# Altium schematic sheet digital_io.SchDoc: foxBMS BMS-Slave 12-Cell
size A3; DocumentNumber: 11; SheetNumber: 11; SheetTotal: 11; AUTHOR: Fraunhofer IISB foxBMS Team; SheetDescription: Digital Inputs/Outputs
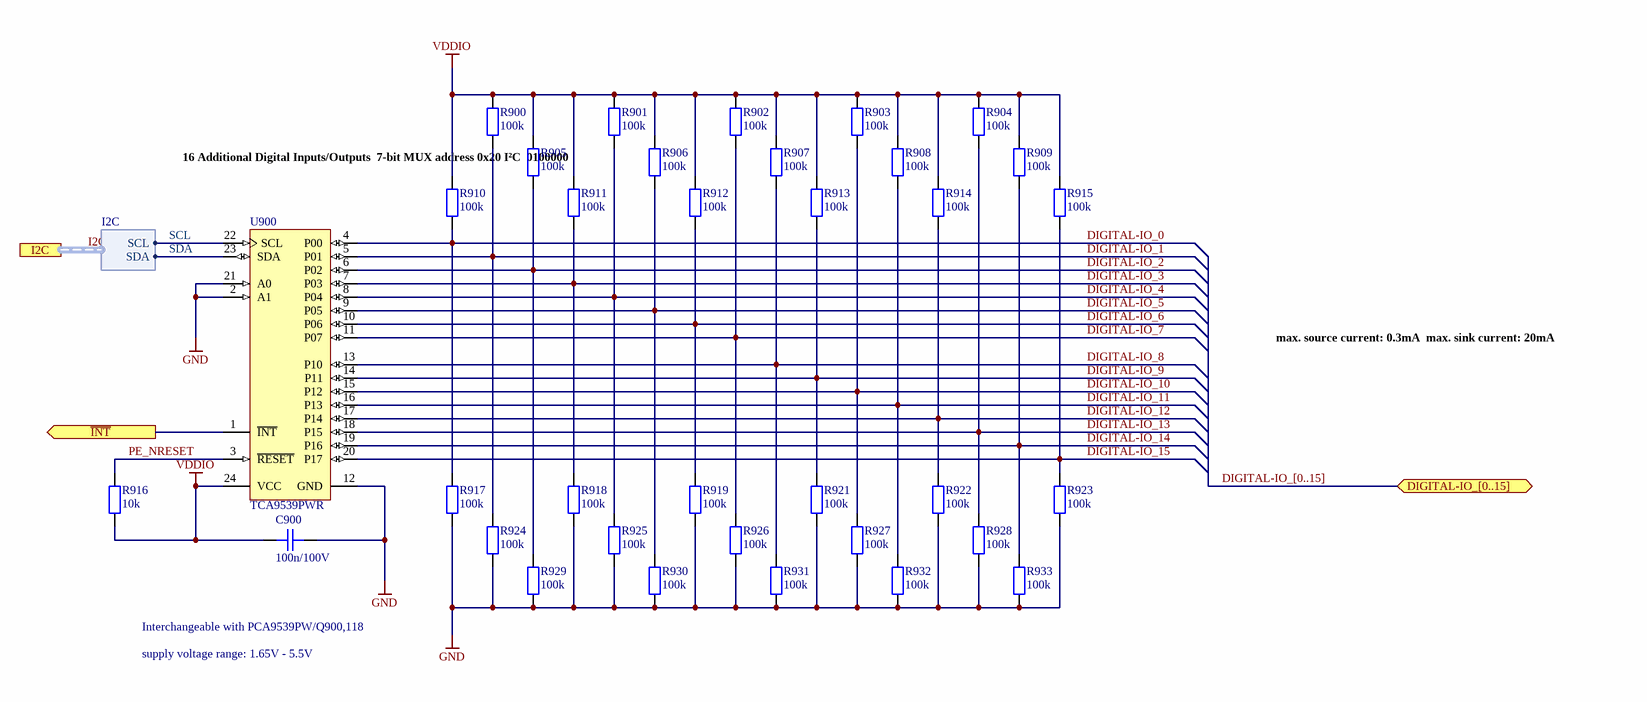
[diagram p0: digital_io.SchDoc]

## Parts
C900  100n/100V  [CAPC1608X08N]
R900  100k  [RESC1608X05N]
R901  100k  [RESC1608X05N]
R902  100k  [RESC1608X05N]
R903  100k  [RESC1608X05N]
R904  100k  [RESC1608X05N]
R905  100k  [RESC1608X05N]
R906  100k  [RESC1608X05N]
R907  100k  [RESC1608X05N]
R908  100k  [RESC1608X05N]
R909  100k  [RESC1608X05N]
R910  100k  [RESC1608X05N]
R911  100k  [RESC1608X05N]
R912  100k  [RESC1608X05N]
R913  100k  [RESC1608X05N]
R914  100k  [RESC1608X05N]
R915  100k  [RESC1608X05N]
R916  10k  [RESC1608X05N]
R917  100k  [RESC1608X05N]
R918  100k  [RESC1608X05N]
R919  100k  [RESC1608X05N]
R921  100k  [RESC1608X05N]
R922  100k  [RESC1608X05N]
R923  100k  [RESC1608X05N]
R924  100k  [RESC1608X05N]
R925  100k  [RESC1608X05N]
R926  100k  [RESC1608X05N]
R927  100k  [RESC1608X05N]
R928  100k  [RESC1608X05N]
R929  100k  [RESC1608X05N]
R930  100k  [RESC1608X05N]
R931  100k  [RESC1608X05N]
R932  100k  [RESC1608X05N]
R933  100k  [RESC1608X05N]
U900  TCA9539PWR  [PW0024A_M]

## Ports
DIGITAL-IO_[0..15] (bidir), I2C (harness I2C), ~{INT} (out)

## Harnesses
I2C: SCL, SDA

## Nets
GND: C900.1 R917.1 R918.1 R919.1 R921.1 R922.1 R923.1 R924.1 R925.1 R926.1 R927.1 R928.1 R929.1 R930.1 R931.1 R932.1 R933.1 U900.2(A1) U900.12(GND) U900.21(A0)
VDDIO: C900.2 R900.2 R901.2 R902.2 R903.2 R904.2 R905.2 R906.2 R907.2 R908.2 R909.2 R910.2 R911.2 R912.2 R913.2 R914.2 R915.2 R916.1 U900.24(VCC)
DIGITAL-IO_0: R910.1 R917.2 U900.4(P00)
DIGITAL-IO_1: R900.1 R924.2 U900.5(P01)
DIGITAL-IO_2: R905.1 R929.2 U900.6(P02)
DIGITAL-IO_3: R911.1 R918.2 U900.7(P03)
DIGITAL-IO_4: R901.1 R925.2 U900.8(P04)
DIGITAL-IO_5: R906.1 R930.2 U900.9(P05)
DIGITAL-IO_6: R912.1 R919.2 U900.10(P06)
DIGITAL-IO_7: R902.1 R926.2 U900.11(P07)
DIGITAL-IO_8: R907.1 R931.2 U900.13(P10)
DIGITAL-IO_9: R913.1 R921.2 U900.14(P11)
DIGITAL-IO_10: R903.1 R927.2 U900.15(P12)
DIGITAL-IO_11: R908.1 R932.2 U900.16(P13)
DIGITAL-IO_12: R914.1 R922.2 U900.17(P14)
DIGITAL-IO_13: R904.1 R928.2 U900.18(P15)
DIGITAL-IO_14: R909.1 R933.2 U900.19(P16)
DIGITAL-IO_15: R915.1 R923.2 U900.20(P17)
~{INT}: U900.1(~{INT}) ; port ~{INT}
PE_NRESET: R916.2 U900.3(~{RESET})
SCL: U900.22(SCL) ; port I2C.SCL  [project net I2C.SCL]
SDA: U900.23(SDA) ; port I2C.SDA  [project net I2C.SDA]

## Buses and harness runs
bus DIGITAL-IO_[0..15] = port DIGITAL-IO_[0..15]
harness I2C = port I2C

## Notes on the sheet
- (near R905) 16 Additional Digital Inputs/Outputs
  7-bit MUX address 0x20 I²C
  0100000
- max. source current: 0.3mA
  max. sink current: 20mA
- Interchangeable with PCA9539PW/Q900,118
- supply voltage range: 1.65V - 5.5V
- Fraunhofer IISB
- Schottkystr. 10
- developed by:
- 91058 Erlangen
- Germany
- Author
- Project
- License
- Description
- File
- Version
- Release Date
- Sheet
- foxbms.org <https://foxbms.org>
- www.iisb.fraunhofer.de <https://www.iisb.fraunhofer.de/>
- foxBMS Team
- /

## Library data of the parts
C900 = gen_C_ceramic_100n_100V_X7R_0603: MLCC; Capacitance: 100n; Rated Voltage: 100V; Dielectric: X7R; Case EIA: 0603; Case Metric: 1608; Automotive Qualified: True; PnP Package: 0603C; Part Number: gen_C_ceramic_100n_100V_X7R_0603; Supplier 1: Digikey; Supplier Part Number 1: 490-13420-1-ND; Supplier 2: Mouser; Supplier Part Number 2: 81-GCJ188R72A104KA1D
R900-R915 R917-R919 R921-R933 = gen_R_100k_0603: SMD Resistor 100k 0603; Tolerance: 1%; Power: 0.1W; Case EIA: 0603; Case Metric: 1608; Maximum Working Voltage: 75V; PnP Package: 0603R; Automotive Qualified: True; PnP equipped: x; Part Number: gen_R_100k_0603; Operating Temperature: -55°C - +155°C; Resistance: 100k; Series: E24, E96; PnP Value: 100k; Supplier 1: Farnell; Supplier Part Number 1: 2303232
R916 = gen_R_10k_0603: SMD Resistor 10k 0603; Tolerance: 1%; Power: 0.1W; Case EIA: 0603; Case Metric: 1608; Maximum Working Voltage: 75V; PnP Package: 0603R; Automotive Qualified: True; Part Number: gen_R_10k_0603; Operating Temperature: -55°C - +155°C; Resistance: 10k; Series: E24, E96; PnP Value: 10k; Supplier 1: Farnell; Supplier Part Number 1: 2073349
U900 = CMP-0314-00251-2: Remote 16-Bit I2C and SMBus, Low-Power I/O Expander with Interrupt Output, Reset & Config. Register, 1.65 to 5.5 V, -40 to 85 degC, 24-pin TSSOP (PW), Green (RoHS & no Sb/Br); Manufacturer: Texas Instruments; Interrupt Output: Yes; SubFamily: I2C IO Expander; I2C Address: 1110 1xx; # of I/Os: 16; Max Frequency(kHz): 400; 5V Tolerant I/O: Yes; ComponentLink1Description: Datasheet; PartNumber: TCA9539PWR; Eco-Plan: Green (RoHS & no Sb/Br); Reset Input: Yes; ComponentLink2Description: Package Specification; Mounting Technology: Surface Mount; PackageReference: PW0024A; DatasheetVersion: SCPS202A; ComponentLink1URL: http://www.ti.com/general/docs/lit/getliterature.tsp?genericPartNumber=TCA9539&fileType=pdf; Vcc range(V): 1.65 to 5.5; Low Power: Yes; Code_JEDEC: MO-153; Configuration Registers: Yes; PackageVersion: revG, Feb-2011; PackageDescription: 24-Pin Thin Small Outline Package 0.65 mm Pitch; Push-Pull I/O Type: Yes; ComponentLink2URL: http://www.ti.com/litv/pdf/mpds177g